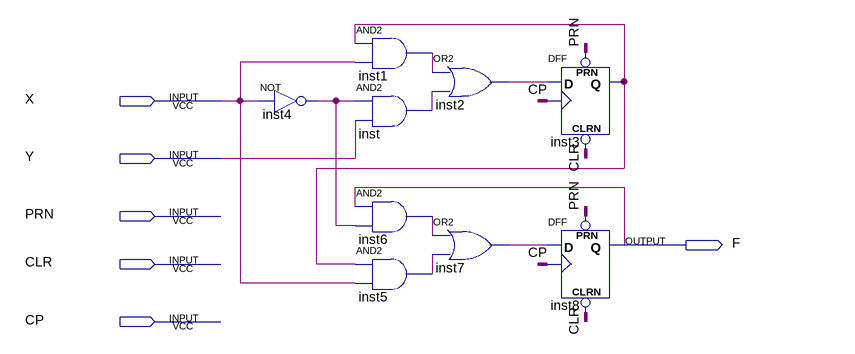
[diagram p0: schematic sheet]
// Quartus schematic PracticeProblem1.bdf as structural Verilog: 9 symbols, 6 pins
module PracticeProblem1 (
  input  X,
  input  Y,
  input  PRN,
  input  CLR,
  input  CP,
  output F
);

  wire inst1_out, inst2_out, inst3_q, inst4_out, inst5_out, inst6_out, inst7_out, inst_out;

  not inst4 (inst4_out, X);
  and inst1 (inst1_out, inst3_q, X);
  and inst (inst_out, inst4_out, Y);
  and inst6 (inst6_out, F, inst4_out);
  and inst5 (inst5_out, inst3_q, X);
  or inst2 (inst2_out, inst1_out, inst_out);
  or inst7 (inst7_out, inst6_out, inst5_out);
  DFF inst3 (.CLRN(CLR), .CLK(CP), .D(inst2_out), .PRN(PRN), .Q(inst3_q));
  DFF inst8 (.CLRN(CLR), .CLK(CP), .D(inst7_out), .PRN(PRN), .Q(F));
endmodule
